# Altium schematic sheet 15_PowerSupply.SchDoc: Board power supply (part 3 of 3)
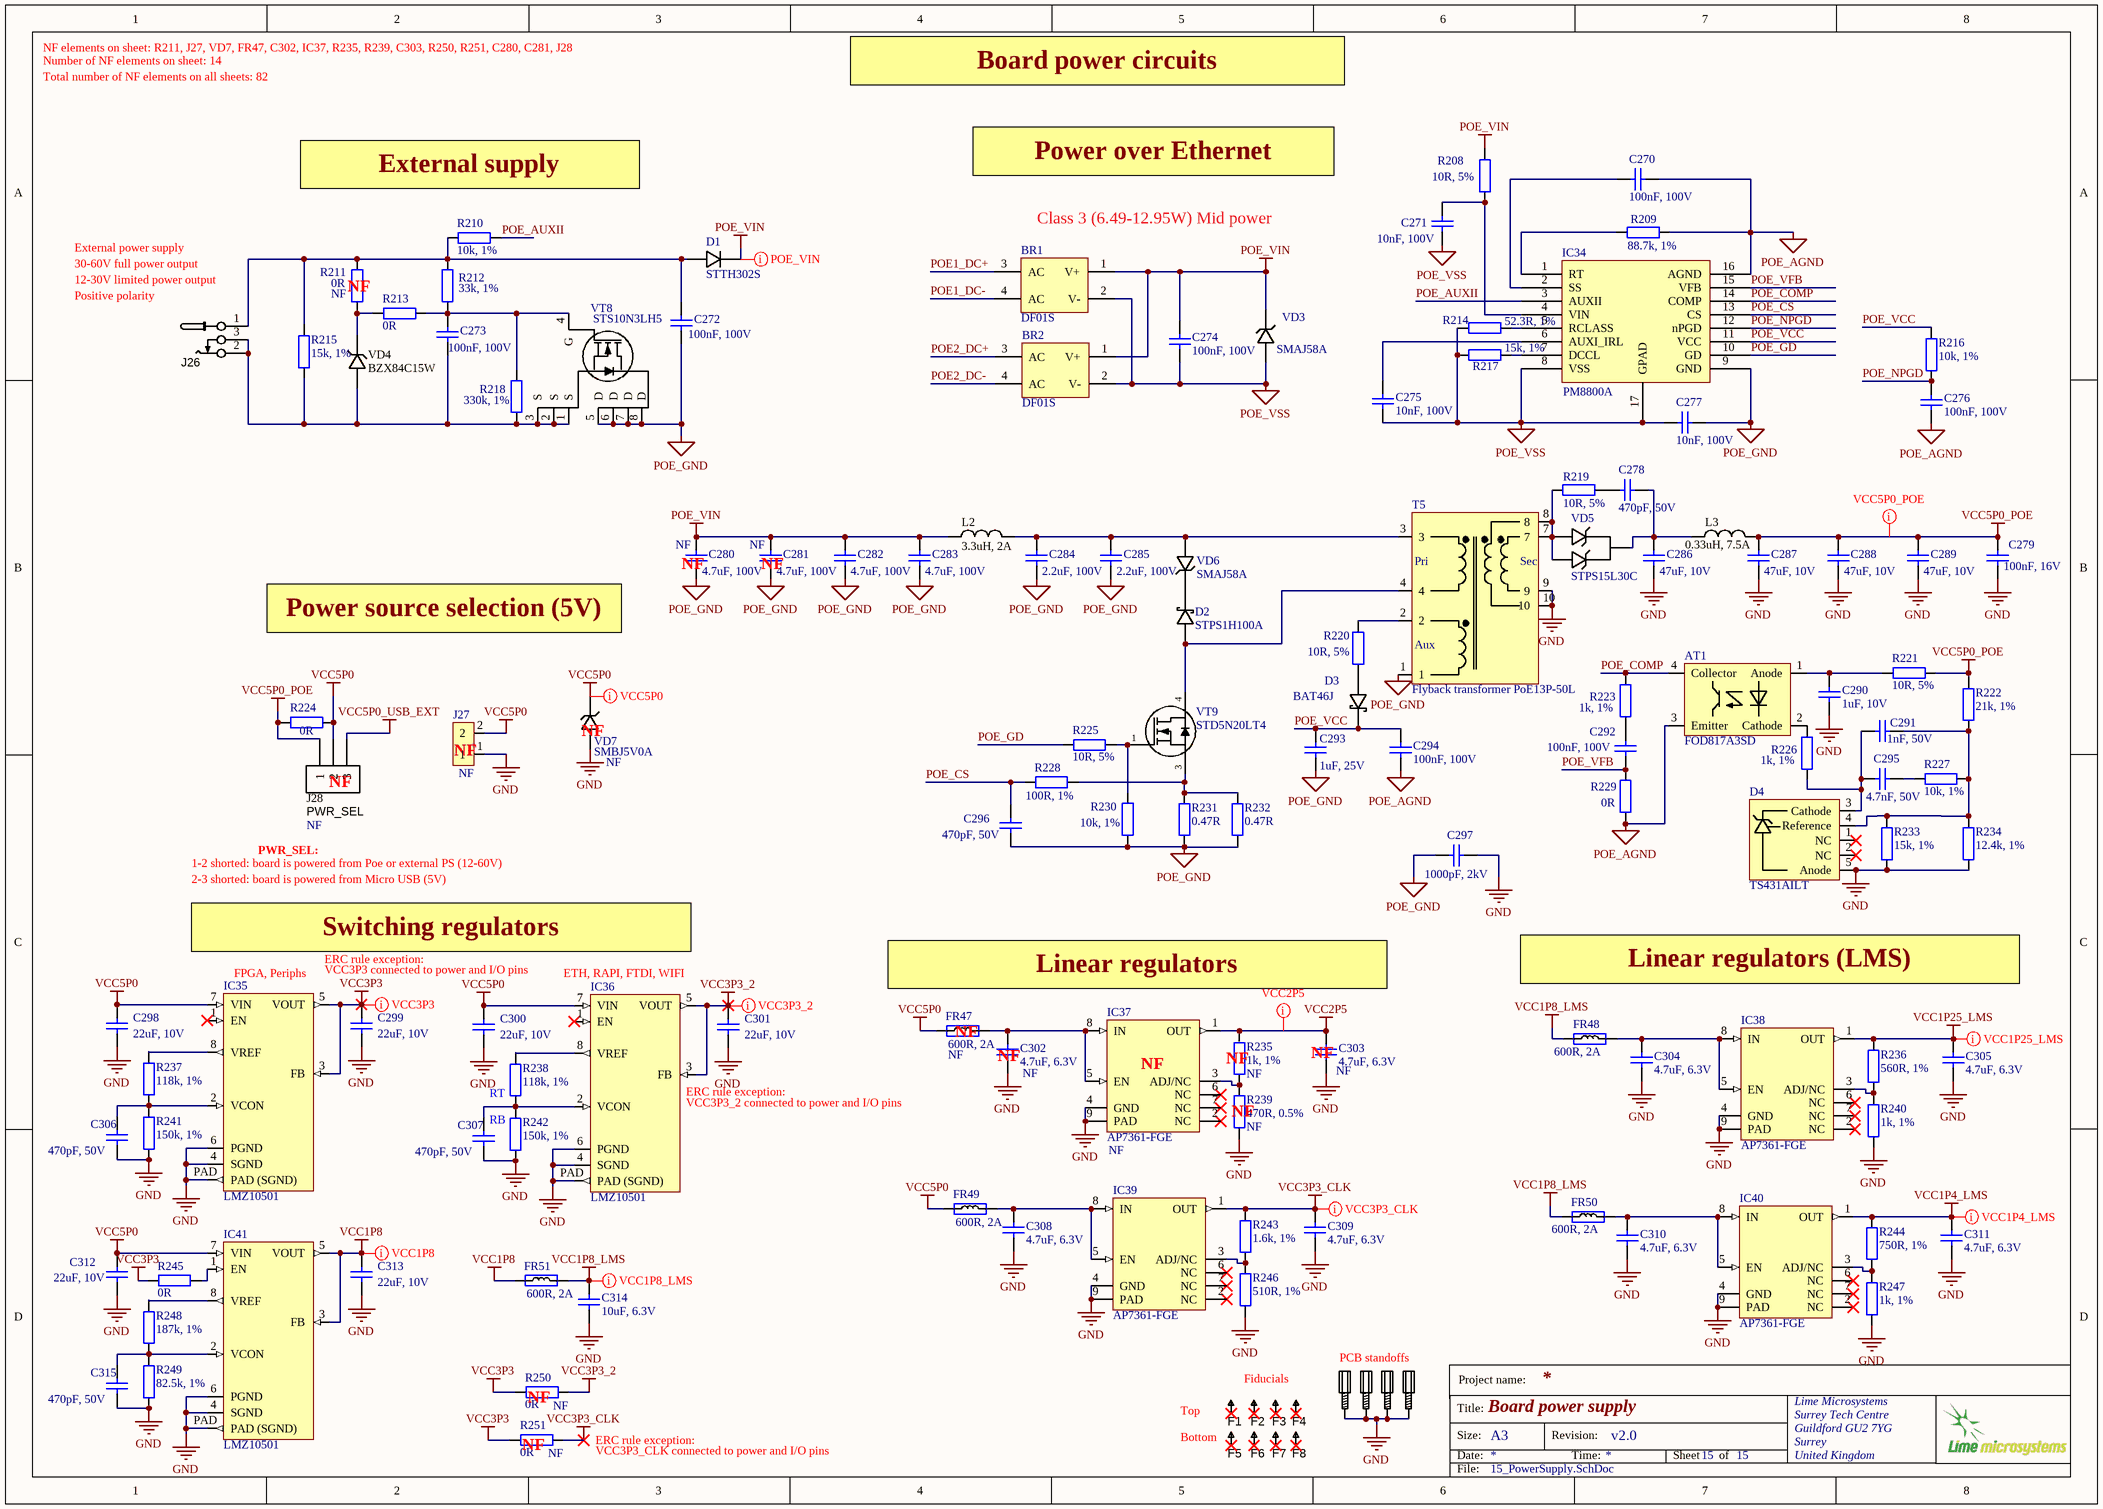
[diagram p2: 15_PowerSupply.SchDoc]

## Library data of the parts (continued)
VD4 = BZX84C15W_DIODE_ZENER: Part Description: Zener Diode 15V 200mW ±6% Surface Mount SOT-323; Manufacturer: Diodes; Manufacturer Part Number 1: BZX84C15W-7-F; Max Power Dissipation: 200mW; Tolerance: 6%; Zener Voltage: 15V; Impedance: 30R; Max Reverse Leakage Current: 100nA; Zener Current: 5mA; Element Configuration: Single; Output Current: 23mA; ESD Protection: No; ComponentLink1URL: http://www.onsemi.com/pub/Collateral/BZX84C2V4LT1-D.PDF; ComponentLink1Description: http://www.onsemi.com/pub/Collateral/BZX84C2V4LT1-D.PDF; ComponentLink2URL: https://www.verical.com/server-webapp/html/getDatasheet?partID=101861; ComponentLink2Description: https://www.verical.com/server-webapp/html/getDatasheet?partID=101861; ComponentLink3URL: http://www.farnell.com/datasheets/1874542.pdf; ComponentLink3Description: http://www.farnell.com/datasheets/1874542.pdf; ComponentLink4URL: https://www.alliedelec.com/m/d/89a0f5fa5faf07909887b6182710b562.pdf; ComponentLink4Description: https://www.alliedelec.com/m/d/89a0f5fa5faf07909887b6182710b562.pdf; ComponentLink5URL: https://www.onsemi.com/pub/Collateral/BZX84C2V4LT1-D.PDF; ComponentLink5Description: https://www.onsemi.com/pub/Collateral/BZX84C2V4LT1-D.PDF; ComponentLink6URL: http://www.onsemi.com/pub_link/Collateral/BZX84C2V4LT1-D.PDF; ComponentLink6Description: http://www.onsemi.com/pub_link/Collateral/BZX84C2V4LT1-D.PDF; Supplier 1: Digi-Key; Stock 1: 4066; Pricing 1: 1=0.38, 10=0.284, 100=0.161, 500=0.1066, 1000=0.08173 (USD); Mount: Surface Mount; Case/Package: SOT-323; Number of Pins: 3; Weight: 0.000212oz; Contact Plating: Matte,Tin; Min Operating Temperature: -65°C; Max Operating Temperature: 125°C; Packaging: Tape and Reel; Package Quantity: 3000; Power Dissipation: 200mW; Voltage Tolerance: 6%; Test Current: 5mA; Termination: SMD/SMT; Peak Reverse Current: 100nA; Power Rating: 200mW; Voltage Rating (DC): 15V; Length: 2.2mm; Height: 1mm; Width: 1.35mm; Radiation Hardening: No; Lead Free: Lead Free; ComponentLink7URL: http://www.diodes.com/datasheets/ds30066.pdf; ComponentLink7Description: http://www.diodes.com/datasheets/ds30066.pdf; ComponentLink8URL: https://www.diodes.com/assets/Datasheets/ds30066.pdf; ComponentLink8Description: https://www.diodes.com/assets/Datasheets/ds30066.pdf; ComponentLink9URL: http://www.diodes.com//datasheets/ds30066.pdf; ComponentLink9Description: http://www.diodes.com//datasheets/ds30066.pdf; Supplier Part Number 1: BZX84C15W-FDIDKR-ND
VD5 = STPS15L30C_shottky_rectifier: Part Description: Diode Array 1 Pair Common Cathode Schottky 30V 7.5A Surface Mount TO-252-3, DPak (2 Leads + Tab), SC-63; Manufacturer: STMicroelectronics; Manufacturer Part Number 1: STPS15L30CB-TR; Element Configuration: Common Cathode; Forward Current: 15A; Peak Reverse Current: 1mA; Forward Voltage: 570mV; Average Rectified Current: 7.5A; Max Repetitive Reverse Voltage (Vrrm): 30V; Max Forward Surge Current (Ifsm): 75A; Supplier 1: Digi-Key; Stock 1: 5072; Pricing 1: 1=1.48, 10=1.327, 100=1.0343, 500=0.8544, 1000=0.67453 (USD); Mount: Surface Mount; Case/Package: DPAK; Number of Pins: 3; Contact Plating: Matte,Tin; Min Operating Temperature: -65°C; Max Operating Temperature: 150°C; Package Quantity: 2500; Packaging: Tape and Reel; Peak Non-Repetitive Surge Current: 75A; Current Rating: 15A; Voltage Rating (DC): 30V; Max Reverse Voltage (DC): 30V; Radiation Hardening: No; Lead Free: Lead Free; ComponentLink1URL: http://www.st.com/content/ccc/resource/technical/document/datasheet/1f/cc/d5/79/c8/b2/47/15/CD00002832.pdf/files/CD00002832.pdf/jcr:content/translations/en.CD00002832.pdf; ComponentLink1Description: http://www.st.com/content/ccc/resource/technical/document/datasheet/1f/cc/d5/79/c8/b2/47/15/CD00002832.pdf/files/CD00002832.pdf/jcr:content/translations/en.CD00002832.pdf; ComponentLink2URL: http://www.mouser.com/ds/2/389/stps15l30c-956623.pdf; ComponentLink2Description: http://www.mouser.com/ds/2/389/stps15l30c-956623.pdf; Supplier Part Number 1: 497-6574-6-ND
VD7 = DIODE_TVS_UNIDIR: SMAJ12CA-13-F; Manufacturer: ON Semiconductor; Part Description: TVS DIODE 5V 9.2V DO214AA; Voltage - Breakdown (Min): 6.4V; Type: Zener; Voltage - Clamping (Max) @ Ipp: 9.2V; Power Line Protection: No; Voltage - Reverse Standoff (Typ): 5V; Current - Peak Pulse (10/1000µs): 65.2A; Power - Peak Pulse: 600W; Category: Circuit Protection; Packaging: Cut Tape (CT); Operating Temperature: -55°C ~ 150°C (TJ); Package / Case: DO-214AA, SMB; Supplier Part Number 1: SMBJ5V0ACT-ND; Part Status: Discontinued at Digi-Key; Manufacturer Part Number 1: SMBJ5V0A; Supplier Device Package: DO-214AA (SMB); Mounting Type: Surface Mount; Supplier 1: Digi-Key; RoHS: RoHS Compliant; Base Part Number: SMBJ5V0; Applications: General Purpose; Capacitance @ Frequency: -; Value: SMBJ5V0A
VT8 = STS10N3LH5_NMOS: Part Description: N-Channel 30V 10A (Tc) 2.5W (Tc) Surface Mount 8-SO; Manufacturer: STMicroelectronics; Rds On Max: 21mR; Input Capacitance: 475pF; Rise Time: 22ns; Drain to Source Voltage (Vdss): 30V; Continuous Drain Current (ID): 10A; Max Power Dissipation: 2.5W; Turn-On Delay Time: 4ns; Turn-Off Delay Time: 13ns; Fall Time: 2.8ns; Gate to Source Voltage (Vgs): 22V; ComponentLink1URL: http://www.st.com/web/en/resource/technical/document/datasheet/CD00103832.pdf; ComponentLink1Description: http://www.st.com/web/en/resource/technical/document/datasheet/CD00103832.pdf; ComponentLink2URL: http://www.st.com/content/ccc/resource/technical/document/datasheet/00/75/48/c3/62/90/4a/32/CD00103832.pdf/files/CD00103832.pdf/jcr:content/translations/en.CD00103832.pdf; ComponentLink2Description: http://www.st.com/content/ccc/resource/technical/document/datasheet/00/75/48/c3/62/90/4a/32/CD00103832.pdf/files/CD00103832.pdf/jcr:content/translations/en.CD00103832.pdf; ComponentLink3URL: http://www.mouser.com/ds/2/389/CD00103832-114014.pdf; ComponentLink3Description: http://www.mouser.com/ds/2/389/CD00103832-114014.pdf; Supplier 1: Digi-Key; Manufacturer Part Number: STS10N3LH5; Stock 1: 4194; Pricing 1: 1=1.38, 10=1.219, 100=0.9632, 500=0.74698, 1000=0.58973 (USD); Mount: Surface Mount; Case/Package: SOIC; Number of Pins: 8; Min Operating Temperature: -55°C; Max Operating Temperature: 150°C; Package Quantity: 2500; Packaging: Tape and Reel; Radiation Hardening: No; Lead Free: Lead Free; ComponentLink4URL: http://www.st.com/web/en/resource/technical/document/datasheet/CD00232229.pdf; ComponentLink4Description: http://www.st.com/web/en/resource/technical/document/datasheet/CD00232229.pdf; ComponentLink5URL: http://www.st.com/content/ccc/resource/technical/document/datasheet/53/fc/cf/05/f9/85/43/7e/CD00232229.pdf/files/CD00232229.pdf/jcr:content/translations/en.CD00232229.pdf; ComponentLink5Description: http://www.st.com/content/ccc/resource/technical/document/datasheet/53/fc/cf/05/f9/85/43/7e/CD00232229.pdf/files/CD00232229.pdf/jcr:content/translations/en.CD00232229.pdf; Supplier Part Number 1: 497-10010-1-ND
VT9 = STD5N20LT4_NMOS: Manufacturer: STMicroelectronics; Part Description: N-Channel 200V 5A (Tc) 33W (Tc) Surface Mount DPAK; Nominal Vgs: 2.5V; Rise Time: 21.5ns; Rds On Max: 700mR; Input Capacitance: 242pF; Number of Elements: 1; Max Power Dissipation: 33W; Dual Supply Voltage: 200V; Continuous Drain Current (ID): 5A; Fall Time: 15.5ns; Drain to Source Resistance: 650mR; Turn-Off Delay Time: 14ns; Turn-On Delay Time: 11.5ns; Element Configuration: Single; Gate to Source Voltage (Vgs): 20V; Supplier 1: Digi-Key; Manufacturer Part Number 1: STD5N20LT4; Stock 1: 3027; Pricing 1: 1=1.17, 10=1.033, 100=0.8161, 500=0.6329, 1000=0.49965 (USD); Mount: Surface Mount; Case/Package: DPAK; Number of Pins: 3; Min Operating Temperature: -55°C; Max Operating Temperature: 150°C; Packaging: Tape and Reel; Package Quantity: 2500; Drain to Source Voltage (Vdss): 200V; Drain to Source Breakdown Voltage: 200V; Power Dissipation: 33W; On-State Resistance: 700mR; Threshold Voltage: 2.5V; Termination: SMD/SMT; Voltage Rating (DC): 200V; Current Rating: 5A; Length: 6.6mm; Height: 2.4mm; Width: 6.2mm; Radiation Hardening: No; REACH SVHC: No SVHC; Lead Free: Lead Free; ComponentLink1URL: http://www.farnell.com/datasheets/1689960.pdf; ComponentLink1Description: http://www.farnell.com/datasheets/1689960.pdf; ComponentLink2URL: http://www.st.com/content/ccc/resource/technical/document/datasheet/group2/51/4c/d5/e5/c6/ef/43/17/CD00043538/files/CD00043538.pdf/jcr:content/translations/en.CD00043538.pdf; ComponentLink2Description: http://www.st.com/content/ccc/resource/technical/document/datasheet/group2/51/4c/d5/e5/c6/ef/43/17/CD00043538/files/CD00043538.pdf/jcr:content/translations/en.CD00043538.pdf; ComponentLink3URL: http://www.st.com/web/en/resource/technical/document/datasheet/CD00043538.pdf; ComponentLink3Description: http://www.st.com/web/en/resource/technical/document/datasheet/CD00043538.pdf; Supplier Part Number 1: 497-4335-6-ND